# Altium schematic sheet 06_Reset.SchDoc: Reset
size A; Revision: A; SheetNumber: 6; SheetTotal: 6
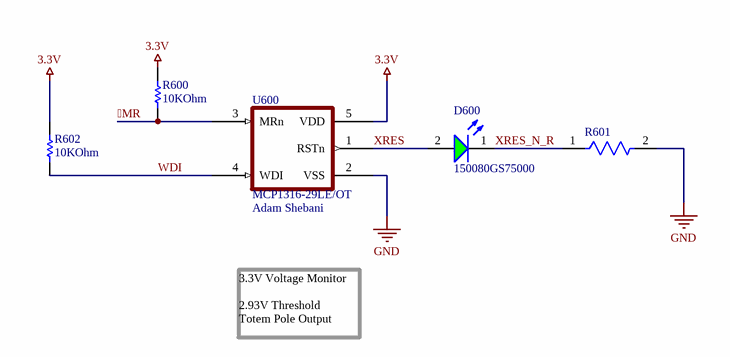
[diagram p0: 06_Reset.SchDoc]

## Parts
D600  150080GS75000  [WL-SMCW_0805_150080xx75000]
R600  Resistance: 10KOhm  [RESC3116X65X40ML10T20]  (hidden comment: RC1206FR-0710KL)
R601  RMCF1206JT330R  [FP-RMCF1206-MFG]  (value not drawn)
R602  Resistance: 10KOhm  [RESC3116X65X40ML10T20]  (hidden comment: RC1206FR-0710KL)
U600  MCP1316-29LE/OT  Drawn By: Adam Shebani  [SOT23-5-MCP-1316T]

## Nets
3.3V: R600.2 R602.2 U600.5(VDD)
GND: R601.2 U600.2(VSS)
MR: R600.1 U600.3(MRn)
WDI: R602.1 U600.4(WDI)
XRES: D600.2(A) U600.1(RSTn)
XRES_N_R: D600.1(K) R601.1

## Notes on the sheet
- 3.3V Voltage Monitor
  2.93V Threshold
  Totem Pole Output
- Title:
- Size:
- A
- Project
- Rev:
- Sheet:
- of
- College of Engineering
- 1415 Engineering Drive
- Madison, WI 53706

## Library data of the parts
D600 = CMP-1426-00007-3: WURTH ELEKTRONIK - 150080GS75000 - LED, Green, SMD, 0805, 30 mA, 3.2 V, 520 nm; Wavelength: 525nm; Forward Current: 100mA; Lens Style: Clear, Rectangular; Max Junction Temperature (Tj): 95°C; Power Dissipation: 105mW; Luminous Intensity: 450mcd; Peak Wavelength: 515nm; Viewing Angle: 140°; Test Current: 20mA; Reverse Voltage: 5V; Forward Voltage: 3.2V; Mount: Surface Mount; Dominant Wavelength: 525nm; REACH SVHC: Unknown; Min Operating Temperature: -40°C; Case Code (Imperial): 0805; Case/Package: 0805; Max Operating Temperature: 85°C; RoHS: Compliant; Length: 2mm; Height: 700µm; Width: 1.25mm; Color: Green; Case Code (Metric): 2012; Packaging: Tape and Reel; Max Reverse Voltage (DC): 5V
R600 R602 = CMP-1014-00623-2: Chip Resistor, 10 KOhm, +/- 1%, 0.25 W, -55 to 155 degC, 1206 (3216 Metric), RoHS, Tape and Reel; Manufacturer: Yageo; Voltage Rating: 200V; Temperature Coefficient: 100ppm/degreesC; Power Rating: 250mW; Packaging: TapeandReel; Termination: SMD/SMT; REACH SVHC: Unknown; Tolerance: 1%; Height: 0.55mm; Composition: ThickFilm; Max Operating Temperature: 155degC; Datasheet Version: Rev. 5, 10/2016; Lead Free: LeadFree; Case Code (Metric): 3216; Depth: 1.6mm; Package Quantity: 5000; RoHSCompliant: true; Military Standard: Not; Case/Package: 1206; Case Code (Imperial): 1206; Min Operating Temperature: -55degC; Datasheet URL: http://www.yageo.com/NewPortal/yageodocoutput?fileName=/pdf/R-Chip/PYu-RC_Group_51_RoHS_L_5.pdf; Length: 3.1mm; Manufacturer URL: http://www.yageo.com/; Package Reference: 1206.0; Width: 1.6mm; Package Description: 2-Pin Surface Mount Device, Body 3.1 x 1.6 mm
R601 = CMP-26527-003971-1: 330Ω ±5% 0.25W 1206 Thick Film Chip Resistor AEC-Q200 compliant; Power Rating: 250mW; Resistance: 330R; Temperature Coefficient: 200ppm/°C; Height: 0.028inch; Series: RMCF; Size Code: 1206; Case/Package: 1206; Features: Automotive AEC-Q200; Max Power Dissipation: 250mW; Depth: 1.6mm; Length: 3.2mm; Min Operating Temperature: -55°C; Military Standard: Not; Case Code (Metric): 3216; Radiation Hardening: No; Number of Terminations: 2; Resistor Type: Thick Film; Construction: Rectangular; Packaging: Tape and Reel; Lead Free: Lead Free; Case Code (Imperial): 1206; Contact Plating: Tin; Width: 0.063inch; RoHS Compliant: Yes; Mount: Surface Mount; Max Operating Temperature: 155°C; Tolerance: 5%
U600 = MCP1316-29LE/OT: Pwr Sply Func; Voltage Detector, Voltage Supervisor; SOT-23; VS 1 to 5.5V; IS 10uA; Manufacturer: Microchip; Manufacturer Part Number: MCP1316T-29LE/OT; Max Output current: 10mA; Max Power Dissipation: 240mW; Max Reset Threshold Voltage: 2.944V; Max Supply Current: 10µA; Min Reset Threshold Voltage: 2.857V; Min Supply Voltage: 1V; Number of Channels: 1; Quiescent Current: 1µA; Reset: Active Low; Reset Timeout: 140ms; Threshold Voltage: 2.9V; Watchdog Timer: Yes; Supplier: Arrow Electronics; Supplier Part Number: MCP1316T-29LE/OT; RoHS: Compliant; Category: Voltage Supervisors; Stock: 1723; Pricing: 1=0.8561, 10=0.8476, 25=0.6945, 100=0.694, 250=0.6935, 500=0.693, 1000=0.6925 (USD); Projected EOL Date: 2034-11-18; Case/Package: SOT-23; Country of Assembly: Malaysia, Thailand; Country of Fabrication: United States of America; Country of Origin: Malaysia, Thailand; Export Control Classification Number (ECCN) Code: EAR99; Height: 1.2954mm; Harmonized Tariff Schedule (HTS) Code: 8542.39.0060; Introduction Date: 2005-11-18; Length: 3.0988mm; Lifecycle Status: Production; Max Operating Temperature: 125°C; Max Supply Voltage: 5.5V; Min Operating Temperature: -40°C; Mounting Technology: Surface Mount; Nominal Supply Current: 10µA; Number of Elements: 1; Pins: 5; Number of Voltages Monitored: 1; Operating Supply Current: 10µA; Overvoltage Threshold: 2.944V; Packaging: Cut Tape; Power Dissipation: 240mW; Radiation Hardening: No; REACH SVHC: No; Schedule B: 8542390000, 8542390000|8542390000|8542390000|8542390000|8542390000; Termination: SMD/SMT; Type: Simple Reset/Power-On Reset; Undervoltage Threshold: 2.857V; Width: 1.8034mm; ComponentLink1URL: https://datasheet.octopart.com:443/MCP1316T-29LE/OT-Microchip-datasheet-11051608.pdf?src-supplier=Electro+Sonic; ComponentLink1Description: https://datasheet.octopart.com:443/MCP1316T-29LE/OT-Microchip-datasheet-11051608.pdf?src-supplier=Electro+Sonic; ComponentLink2URL: https://datasheet.octopart.com:443/MCP1316T-29LE-OT-Microchip-datasheet-160583330.pdf?src-supplier=Microchip; ComponentLink2Description: https://datasheet.octopart.com:443/MCP1316T-29LE-OT-Microchip-datasheet-160583330.pdf?src-supplier=Microchip; ComponentLink3URL: https://datasheet.octopart.com:443/MCP1316T-29LE/OT-Microchip-datasheet-12520420.pdf?src-supplier=Microchip+SCT; ComponentLink3Description: https://datasheet.octopart.com:443/MCP1316T-29LE/OT-Microchip-datasheet-12520420.pdf?src-supplier=Microchip+SCT; ComponentLink4URL: https://datasheet.octopart.com:443/MCP1316T-29LE/OT-Microchip-datasheet-609017.pdf?src-supplier=Newark; ComponentLink4Description: https://datasheet.octopart.com:443/MCP1316T-29LE/OT-Microchip-datasheet-609017.pdf?src-supplier=Newark; ComponentLink5URL: https://datasheet.octopart.com:443/MCP1316T-29LE/OT-Microchip-datasheet-30575.pdf?src-supplier=Mouser; ComponentLink5Description: https://datasheet.octopart.com:443/MCP1316T-29LE/OT-Microchip-datasheet-30575.pdf?src-supplier=Mouser; ComponentLink6URL: https://datasheet.octopart.com:443/MCP1316T-29LE-OT-Microchip-datasheet-158592061.pdf?src-supplier=SHENGYU+ELECTRONICS; ComponentLink6Description: https://datasheet.octopart.com:443/MCP1316T-29LE-OT-Microchip-datasheet-158592061.pdf?src-supplier=SHENGYU+ELECTRONICS; ComponentLink7URL: https://datasheet.octopart.com:443/MCP1316T-29LE/OT-Microchip-datasheet-9601151.pdf?src-supplier=RS+(Formerly+Allied+Electronics); ComponentLink7Description: https://datasheet.octopart.com:443/MCP1316T-29LE/OT-Microchip-datasheet-9601151.pdf?src-supplier=RS+(Formerly+Allied+Electronics); ComponentLink8URL: http://sigma.octopart.com:80/188449423/materials_sheet/Microchip-MCP1316T-29LE-OT.pdf?src-supplier=Compliance+Statements; ComponentLink8Description: http://sigma.octopart.com:80/188449423/materials_sheet/Microchip-MCP1316T-29LE-OT.pdf?src-supplier=Compliance+Statements; ComponentLink9URL: http://sigma.octopart.com:80/rohs_statement/Microchip-company-71.pdf?src-supplier=Compliance+Statements; ComponentLink9Description: http://sigma.octopart.com:80/rohs_statement/Microchip-company-71.pdf?src-supplier=Compliance+Statements; ComponentLink10URL: http://sigma.octopart.com:80/reach_statement/Microchip-company-70.pdf?src-supplier=Compliance+Statements; ComponentLink10Description: http://sigma.octopart.com:80/reach_statement/Microchip-company-70.pdf?src-supplier=Compliance+Statements; ComponentLink11URL: http://sigma.octopart.com:80/conflict_mineral_statement/Microchip-company-69.pdf?src-supplier=Compliance+Statements; ComponentLink11Description: http://sigma.octopart.com:80/conflict_mineral_statement/Microchip-company-69.pdf?src-supplier=Compliance+Statements; ComponentLink12URL: http://sigma.octopart.com:80/conflict_mineral_statement/Microchip-company-68.pdf?src-supplier=Compliance+Statements; ComponentLink12Description: http://sigma.octopart.com:80/conflict_mineral_statement/Microchip-company-68.pdf?src-supplier=Compliance+Statements